# EAGLE schematic current_sense (EAGLE 9.6.2)
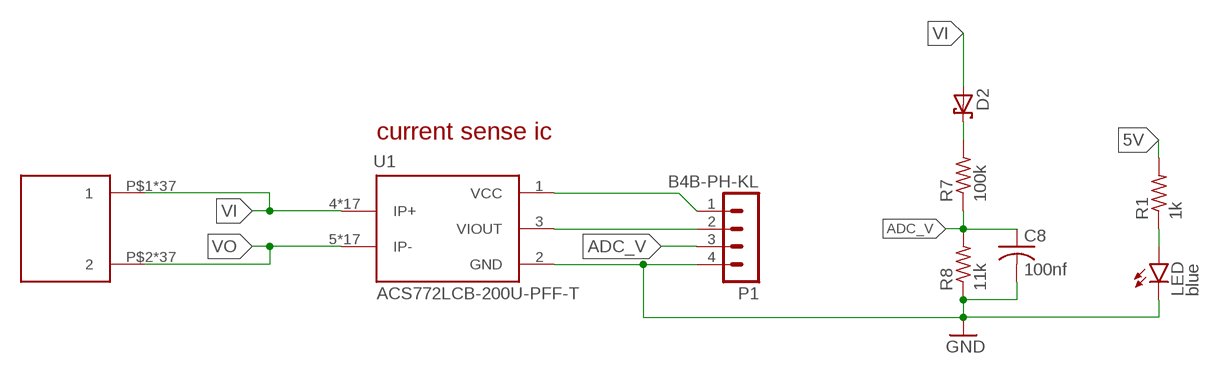
[diagram p0: schematic, sheet 1]

## Parts
C8  100nf  C-USC0805  [C0805]
D2  1PS76SB70,115  [SOD323(F)]
LED  blue  LEDCHIPLED_0805  [CHIPLED_0805]
P1  B4B-PH-KL  [B4B-PH-K-S]
R1  1k  R-US_R0805  [R0805]
R7  100k  R-US_R0805  [R0805]
R8  11k  R-US_R0805  [R0805]
U1  ACS772LCB-200U-PFF-T  ACS772LCB-100U-PFF-T  [XDCR_ACS772LCB-100U-PFF-T]
U$1  CON_PAD  [CON_PAD]

## Nets
5V: P1.1 R1.2 U1.1(VCC)
ADC_V: C8.1 P1.3 R7.1 R8.2
GND: C8.2 LED.C P1.4 R8.1 U1.2(GND)
N$1: P1.2 U1.3(VIOUT)
N$2: LED.A R1.1
N$9: D2.1(K) R7.2
VI: D2.2(A) U1.4(IP+) U1.4_1(IP+) U1.4_2(IP+) U1.4_3(IP+) U1.4_4(IP+) U1.4_5(IP+) U1.4_6(IP+) U1.4_7(IP+) U1.4_8(IP+) U1.4_9(IP+) U1.4_10(IP+) U1.4_11(IP+) U1.4_12(IP+) U1.4_13(IP+) U1.4_14(IP+) U1.4_15(IP+) U1.4_16(IP+) U$1.P$1 U$1.P$3 U$1.P$5 U$1.P$6 U$1.P$7 U$1.P$8 U$1.P$9 U$1.P$10 U$1.P$11 U$1.P$12 U$1.P$13 U$1.P$14 U$1.P$15 U$1.P$16 U$1.P$17 U$1.P$18 U$1.P$19 U$1.P$20 U$1.P$21 U$1.P$22 U$1.P$23 U$1.P$24 U$1.P$25 U$1.P$26 U$1.P$27 U$1.P$28 U$1.P$29 U$1.P$30 U$1.P$31 U$1.P$32 U$1.P$33 U$1.P$34 U$1.P$35 U$1.P$36 U$1.P$37 U$1.P$38 U$1.P$39
VO: U1.5(IP-) U1.5_1(IP-) U1.5_2(IP-) U1.5_3(IP-) U1.5_4(IP-) U1.5_5(IP-) U1.5_6(IP-) U1.5_7(IP-) U1.5_8(IP-) U1.5_9(IP-) U1.5_10(IP-) U1.5_11(IP-) U1.5_12(IP-) U1.5_13(IP-) U1.5_14(IP-) U1.5_15(IP-) U1.5_16(IP-) U$1.P$2 U$1.P$4 U$1.P$40 U$1.P$41 U$1.P$42 U$1.P$43 U$1.P$44 U$1.P$45 U$1.P$46 U$1.P$47 U$1.P$48 U$1.P$49 U$1.P$50 U$1.P$51 U$1.P$52 U$1.P$53 U$1.P$54 U$1.P$55 U$1.P$56 U$1.P$57 U$1.P$58 U$1.P$59 U$1.P$60 U$1.P$61 U$1.P$62 U$1.P$63 U$1.P$64 U$1.P$65 U$1.P$66 U$1.P$67 U$1.P$68 U$1.P$69 U$1.P$70 U$1.P$71 U$1.P$72 U$1.P$73 U$1.P$74

## Notes on the sheet
- current sense ic

## Library data of the parts
C8 = rcl:C-US: CAPACITOR, American symbol; SPICEPREFIX: C
D2 = 1PS76SB70_115:1PS76SB70,115: General-purpose Schottky diode General-purpose Schottky diodes in small Surface-Mounted Device (SMD) plastic packages. AAL Eindhoven MK Check prices <https://pricing.snapeda.com/parts/1PS76SB70%2C115/Nexperia%20USA/view-part?ref=eda>; AVAILABILITY: Good; DESCRIPTION: Diode Schottky 70V 70mA (DC) Surface Mount SOD-323; MF: Nexperia USA; MP: 1PS76SB70,115; PACKAGE: SOD323-2 Nexperia USA Inc.; PRICE: None; PURCHASE-URL: https://pricing.snapeda.com/search/part/1PS76SB70,115/?ref=eda
LED = led:LED: LED OSRAM: - CHIPLED LG R971, LG N971, LY N971, LG Q971, LY Q971, LO R971, LY R971 LH N974, LH R974 LS Q976, LO Q976, LY Q976 LO Q996 - Hyper CHIPLED LW Q18S LB Q993, LB Q99A, LB R99A - SideLED LS A670, LO A670, LY A670, LG A670, LP A670 LB A673, LV A673, LT A673, LW A673 LH A674 LY A675 LS A676, LA A676, LO A676, LY A676, LW A676 LS A679, LY A679, LG A679 - Hyper Micro SIDELED® LS Y876, LA Y876, LO Y876, LY Y876 LT Y87S - SmartLED LW L88C, LW L88S LB L89C, LB L89S, LG L890 LS L89K, LO L89K, LY L89K LS L896, LA L896, LO L896, LY L896 - TOPLED LS T670, LO T670, LY T670, LG T670, LP T670 LSG T670, LSP T670, LSY T670, LOP T670, LYG T670 LG T671, LOG T671, LSG T671 LB T673, LV T673, LT T673, LW T673 LH T674 LS T676, LA T676, LO T676, LY T676, LB T676, LH T676, LSB T676, LW T676 LB T67C, LV T67C, LT T67C, LS T67K, LO T67K, LY T67K, LW E67C LS E67B, LA E67B, LO E67B, LY E67B, LB E67C, LV E67C, LT E67C LW T67C LS T679, LY T679, LG T679 LS T770, LO T770, LY T770, LG T770, LP T770 LB T773, LV T773, LT T773, LW T773 LH T774 LS E675, LA E675, LY E675, LS T675 LS T776, LA T776, LO T776, LY T776, LB T776 LHGB T686 LT T68C, LB T68C - Hyper Mini TOPLED® LB M676 - Mini TOPLED Santana® LG M470 LS M47K, LO M47K, LY M47K Source: http://www.osram.convergy.de LUXEON: - LUMILED® LXK2-PW12-R00, LXK2-PW12-S00, LXK2-PW14-U00, LXK2-PW14-V00 LXK2-PM12-R00, LXK2-PM12-S00, LXK2-PM14-U00 LXK2-PE12-Q00, LXK2-PE12-R00, LXK2-PE12-S00, LXK2-PE14-T00, LXK2-PE14-U00 LXK2-PB12-K00, LXK2-PB12-L00, LXK2-PB12-M00, LXK2-PB14-N00, LXK2-PB14-P00, LXK2-PB14-Q00 LXK2-PR12-L00, LXK2-PR12-M00, LXK2-PR14-Q00, LXK2-PR14-R00 LXK2-PD12-Q00, LXK2-PD12-R00, LXK2-PD12-S00 LXK2-PH12-R00, LXK2-PH12-S00 LXK2-PL12-P00, LXK2-PL12-Q00, LXK2-PL12-R00 Source: www.luxeon.com KINGBRIGHT: KA-3528ASYC Source: www.kingbright.com
P1 = con-JST PH:B4B-PH: JST PH series header 2.00mm pitch disconnectable crimp style connectors, vertical (side entry type), 4 pins
R1 R7 R8 = rcl:R-US_: RESISTOR, American symbol; SPICEPREFIX: R
U1 = ACS772LCB-100U-PFF-T:ACS772LCB-100U-PFF-T: Current Sensor 100A 1 Channel Hall Effect Unidirectional 5-CB Formed Leads, PFF Check prices <https://pricing.snapeda.com/parts/ACS772LCB-100U-PFF-T/Allegro%20MicroSystems%20LLC/view-part?ref=eda>; AVAILABILITY: Bad; DESCRIPTION: Current Sensor 100A 1 Channel Hall Effect Unidirectional 5-CB Formed Leads, PFF; MF: Allegro MicroSystems LLC; MP: ACS772LCB-100U-PFF-T; PACKAGE: 5-CB-5 Allegro MicroSystems LLC; PRICE: None
U$1 = connection_pad:CON_PAD